# Altium schematic sheet CAN.SchDoc
size A4
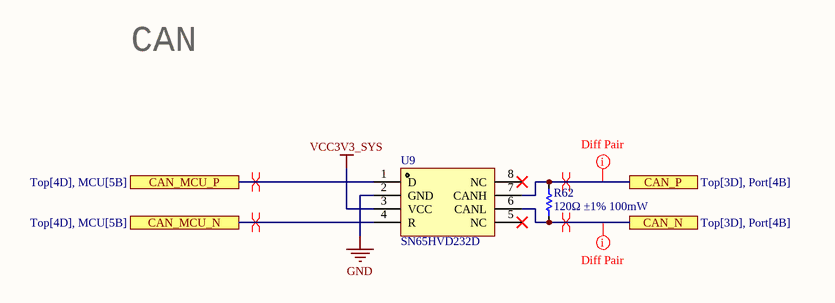
[diagram p0: CAN.SchDoc]

## Parts
R62  120Ω ±1% 100mW  [R0603]
U9  SN65HVD232D  [SOIC127P600X175-8N]

## Ports
CAN_MCU_N (see Top[4D], MCU[5B]), CAN_MCU_P (see Top[4D], MCU[5B]), CAN_N (see Top[3D], Port[4B]), CAN_P (see Top[3D], Port[4B])

## Nets
GND: U9.2(GND)
VCC3V3_SYS: U9.3(VCC)
CAN_MCU_N: U9.4(R) ; port CAN_MCU_N
CAN_MCU_P: U9.1(D) ; port CAN_MCU_P
CAN_N: R62.1 U9.6(CANL) ; port CAN_N
CAN_P: R62.2 U9.7(CANH) ; port CAN_P

Not connected (* = marked no-connect by the designer): U9 5(NC)* 8(NC)*

## Layout directives
differential pair: CAN_MCU_N, CAN_MCU_P, CAN_N, CAN_P
mark named Diff Pair: CAN_N, CAN_P

## Notes on the sheet
- CAN

## Library data of the parts
R62 = Res: Resistor; Published: 8-Jun-2000; LatestRevisionDate: 17-Jul-2002; LatestRevisionNote: Re-released for DXP Platform.; PackageReference: AXIAL-0.3; Publisher: Altium Limited; PackageDescription: Axial Device, Thru-Hole; 2 Leads; 0.3 in Pin Spacing
U9 = SN65HVD232D: Manufacturer: Texas Instruments; Protocol: CAN; Number of Drivers/Receivers: 1/1; Duplex: Half; Data Rate: 1Mbps; Voltage - Supply: 3 V ~ 3.6 V; Supplier 1: Digi-Key; Supplier Part Number 1: 296-26344-2-ND; RoHS: RoHS Compliant; Category: Integrated Circuits (ICs); Stock: 5000; Pricing 1: 2500=0.84375 (USD); Packaging: Tape & Reel (TR); Part Status: Active; Type: Transceiver; Operating Temperature: -40°C ~ 85°C; Mounting Type: Surface Mount; Package / Case: 8-SOIC (0.154", 3.90mm Width); Supplier Device Package: 8-SOIC; ComponentLink1URL: http://www.ti.com/lit/ds/symlink/sn65hvd230.pdf; ComponentLink1Description: http://www.ti.com/lit/ds/symlink/sn65hvd230.pdf; Supplier 2: Digi-Key; Supplier Part Number 2: 296-26344-1-ND; Pricing 2: 1=2.05, 10=1.842, 100=1.4809, 500=1.21668, 1000=1.00811 (USD)